# EAGLE design rf12socket5 (EAGLE 6.3)
ABBREV: jn6; PROJECT: JeeNode v6
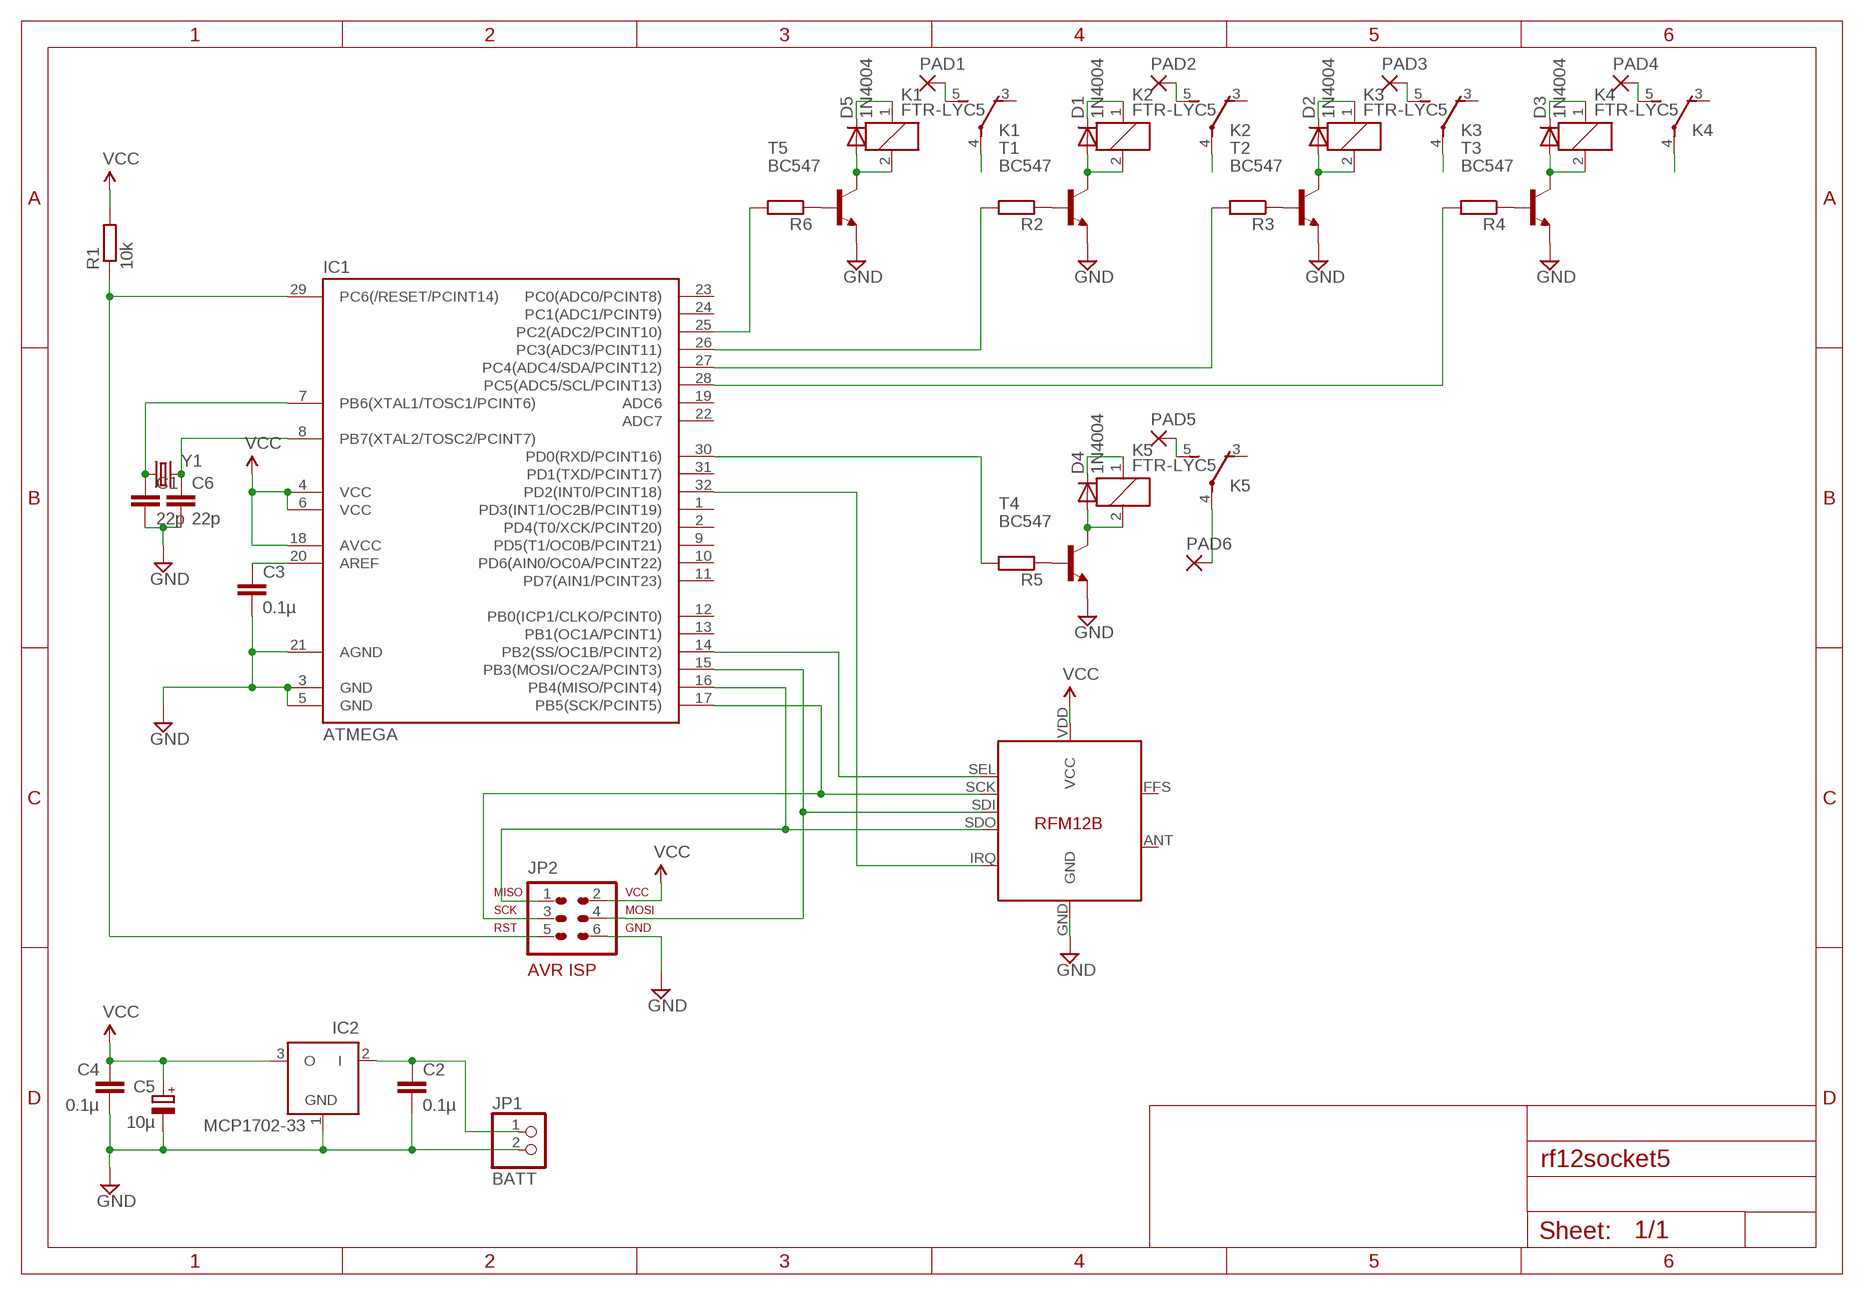
[diagram p0: schematic, sheet 1]

## Parts
C1  22p  CAPPTH  [CAP-PTH-SMALL]
C2  0.1µ  CAP0805  [0805]
C3  0.1µ  CAP0805  [0805]
C4  0.1µ  CAP0805  [0805]
C5  10µ  CPOL-EUE2.5-7  [E2,5-7]
C6  22p  CAPPTH  [CAP-PTH-SMALL]
D1  1N4004  [DO41-10]
D2  1N4004  [DO41-10]
D3  1N4004  [DO41-10]
D4  1N4004  [DO41-10]
D5  1N4004  [DO41-10]
IC1  ATMEGA  MEGA48/88/168-AU  [TQFP32-08]
IC2  MCP1702-33  MCP1702Z  [TO92]
JP1  BATT  PINHD-1X2  [1X02]
JP2  AVR-ISP-6VERT  [AVR-ISP-6]
K1  FTR-LYC5  [FTR-LYC]
K2  FTR-LYC5  [FTR-LYC]
K3  FTR-LYC5  [FTR-LYC]
K4  FTR-LYC5  [FTR-LYC]
K5  FTR-LYC5  [FTR-LYC]
PAD1  SMD5  [SMD2,54-5,08]
PAD2  SMD5  [SMD2,54-5,08]
PAD3  SMD5  [SMD2,54-5,08]
PAD4  SMD5  [SMD2,54-5,08]
PAD5  SMD5  [SMD2,54-5,08]
PAD6  SMD5  [SMD2,54-5,08]
R1  10k  R-EU_0207/10  [0207/10]
R2  R-EU_0207/10  [0207/10]
R3  R-EU_0207/10  [0207/10]
R4  R-EU_0207/10  [0207/10]
R5  R-EU_0207/10  [0207/10]
R6  R-EU_0207/10  [0207/10]
T1  BC547  [TO92]
T2  BC547  [TO92]
T3  BC547  [TO92]
T4  BC547  [TO92]
T5  BC547  [TO92]
U$1  RFM12B  [RFM12B]
Y1  CRYSTALHC49US  [HC49US]

## Nets
GND [power]: C1.2 C2.2 C3.2 C4.2 C5.- C6.2 IC1.3(GND) IC1.5(GND) IC1.21(AGND) IC2.1(GND) JP1.2 JP2.6 T1.1(E) T2.1(E) T3.1(E) T4.1(E) T5.1(E) U$1.GND
L230V: K1.4(-1:P) K2.4(-1:P) K3.4(-1:P) K4.4(-1:P) K5.4(-1:P) PAD6.1(P)
N$1: C1.1 IC1.7(PB6(XTAL1/TOSC1/PCINT6)) Y1.1
N$2: IC1.16(PB4(MISO/PCINT4)) JP2.1 U$1.SDO
N$3: IC1.15(PB3(MOSI/OC2A/PCINT3)) JP2.4 U$1.SDI
N$4: IC1.14(PB2(SS/OC1B/PCINT2)) U$1.SEL
N$5: IC1.17(PB5(SCK/PCINT5)) JP2.3 U$1.SCK
N$6: R2.1 T1.2(B)
N$7: IC1.32(PD2(INT0/PCINT18)) U$1.IRQ
N$8: D1.A K2.2 T1.3(C)
N$9: IC1.25(PC2(ADC2/PCINT10)) R6.2
N$10: R3.1 T2.2(B)
N$11: D2.A K3.2 T2.3(C)
N$12: R4.1 T3.2(B)
N$13: D3.A K4.2 T3.3(C)
N$14: R5.1 T4.2(B)
N$15: R6.1 T5.2(B)
N$16: D5.A K1.2 T5.3(C)
N$17: D4.A K5.2 T4.3(C)
N$18: IC1.26(PC3(ADC3/PCINT11)) R2.2
N$19: C3.1 IC1.20(AREF)
N$20: IC1.27(PC4(ADC4/SDA/PCINT12)) R3.2
N$21: C6.1 IC1.8(PB7(XTAL2/TOSC2/PCINT7)) Y1.2
N$22: IC1.28(PC5(ADC5/SCL/PCINT13)) R4.2
N$23: IC1.30(PD0(RXD/PCINT16)) R5.2
N$24: K5.5(-1:S) PAD5.1(P)
N$25: K1.5(-1:S) PAD1.1(P)
N$26: K2.5(-1:S) PAD2.1(P)
N$27: K3.5(-1:S) PAD3.1(P)
N$28: K4.5(-1:S) PAD4.1(P)
PWR [power]: C2.1 D1.C D2.C D3.C D4.C D5.C IC2.2(I) JP1.1 K1.1 K2.1 K3.1 K4.1 K5.1
RST: IC1.29(PC6(/RESET/PCINT14)) JP2.5 R1.1
VCC [power]: C4.1 C5.+ IC1.4(VCC) IC1.6(VCC) IC1.18(AVCC) IC2.3(O) JP2.2 R1.2 U$1.VDD(VCC)
Unconnected: IC1.1(PD3(INT1/OC2B/PCINT19)) IC1.2(PD4(T0/XCK/PCINT20)) IC1.9(PD5(T1/OC0B/PCINT21)) IC1.10(PD6(AIN0/OC0A/PCINT22)) IC1.11(PD7(AIN1/PCINT23)) IC1.12(PB0(ICP1/CLKO/PCINT0)) IC1.13(PB1(OC1A/PCINT1)) IC1.19(ADC6) IC1.22(ADC7) IC1.23(PC0(ADC0/PCINT8)) IC1.24(PC1(ADC1/PCINT9)) IC1.31(PD1(TXD/PCINT17)) K1.3(-1:O) K2.3(-1:O) K3.3(-1:O) K4.3(-1:O) K5.3(-1:O) U$1.ANT U$1.FFS

## Library data of the parts
C1-C4 C6 = SparkFun:CAP: Capacitor Standard 0603 ceramic capacitor, and 0.1" leaded capacitor.
C5 = rcl:CPOL-EU: POLARIZED CAPACITOR, European symbol
D1-D5 = diode:1N4004: DIODE general purpose rectifier, 1 A
IC1 = avr-7:MEGA48/88/168
IC2 = JeeLabs:MCP1702: 200 mA, Low Power Low Dropout Voltage Regulator
JP1 = pinhead:PINHD-1X2: PIN HEADER
JP2 = avr-7:AVR-ISP-6: AVR ISP-6 Serial Programming Header
K1-K5 = relay:FTR-LYC: Schmales Netzrelais NETZRELAIS FTR-LYCA024V 1XUM 6A/250VAC Distributor: Conrad electronic Bestell Nr.: 504382 - 62 Source: http://www2.produktinfo.conrad.com/datenblaetter/500000-524999/504382-da-01-de-NETZRELAIS_FTR-LYCA024V_1XUM_6A_250VAC.pdf; OC_FARNELL: unknown; OC_NEWARK: unknown
PAD1-PAD6 = wirepad:SMD5: SMD PAD
R1-R6 = rcl:R-EU_: RESISTOR, European symbol
T1-T5 = transistor:BC547: NPN TRANSISTOR
U$1 = JeeLabs:RFM12B
Y1 = SparkFun:CRYSTAL: Crystals Various standard crystals. Proven footprints. Spark Fun Electronics SKU : COM-00534

## Net classes
1 power: width 0.381 mm, clearance 0.254 mm

## Board
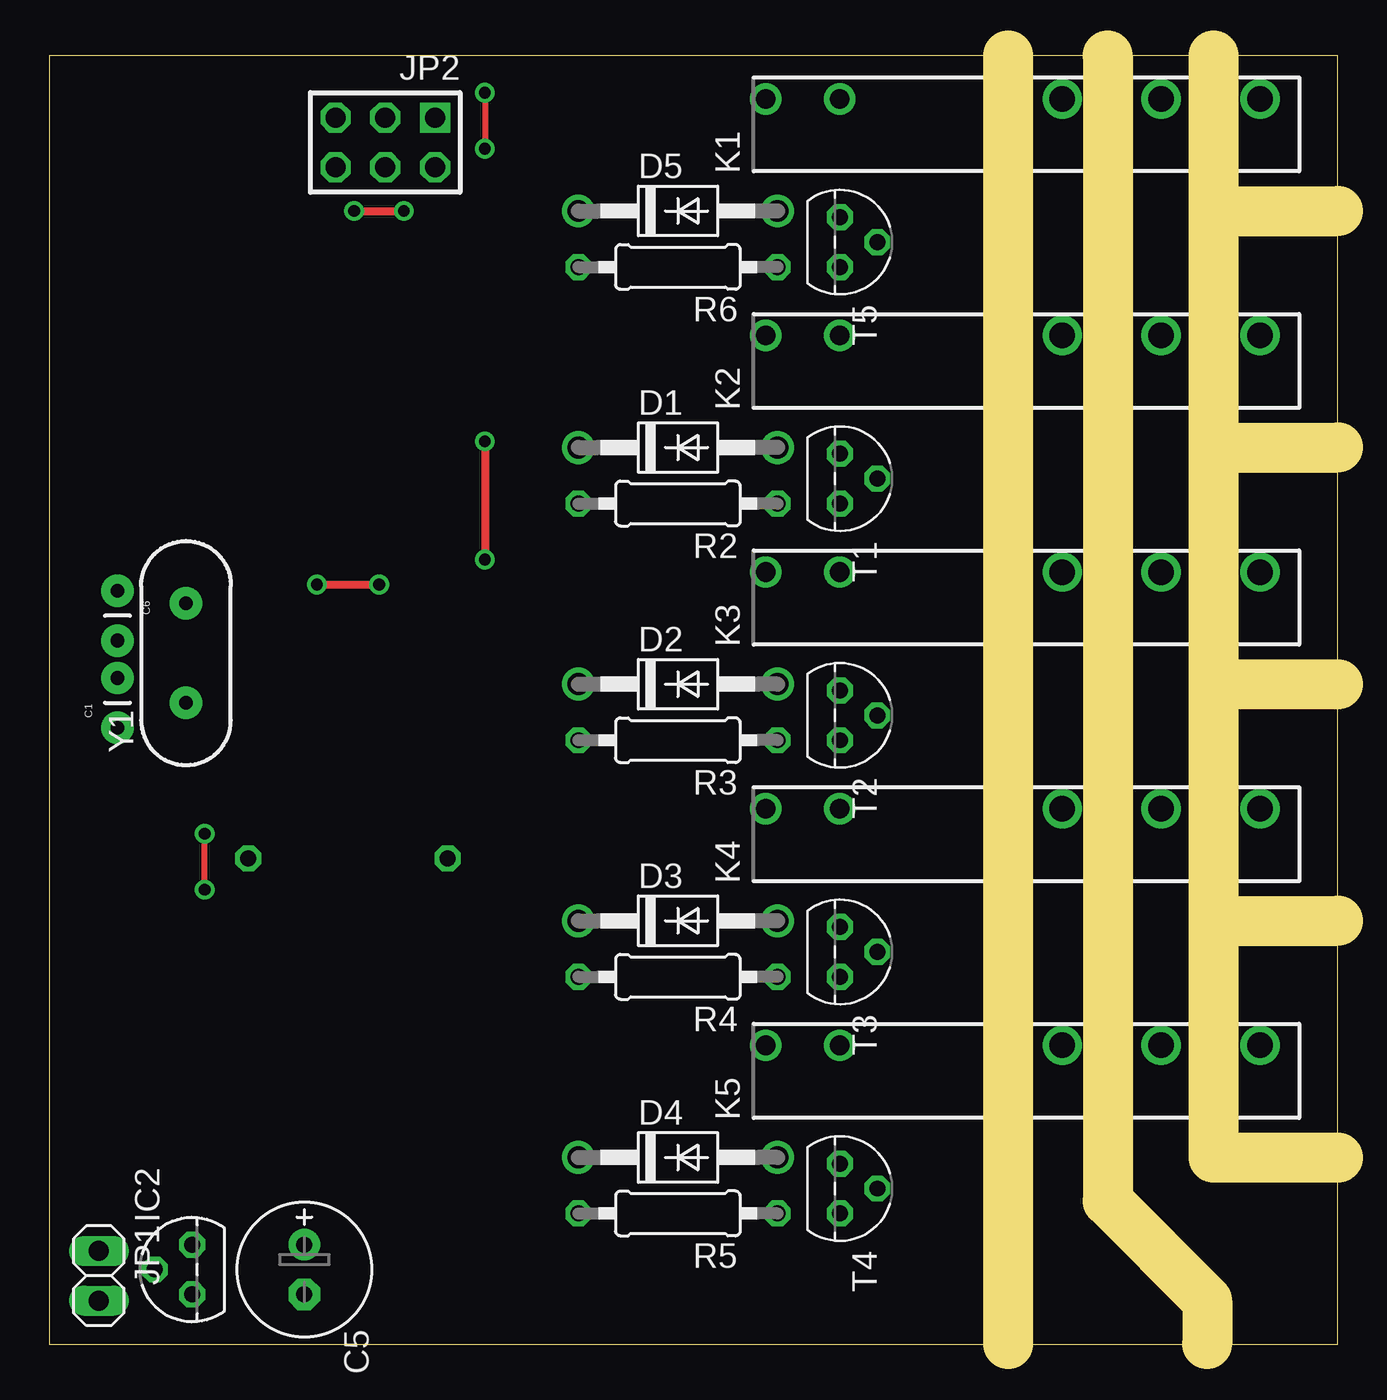
[diagram p1: board, top side]
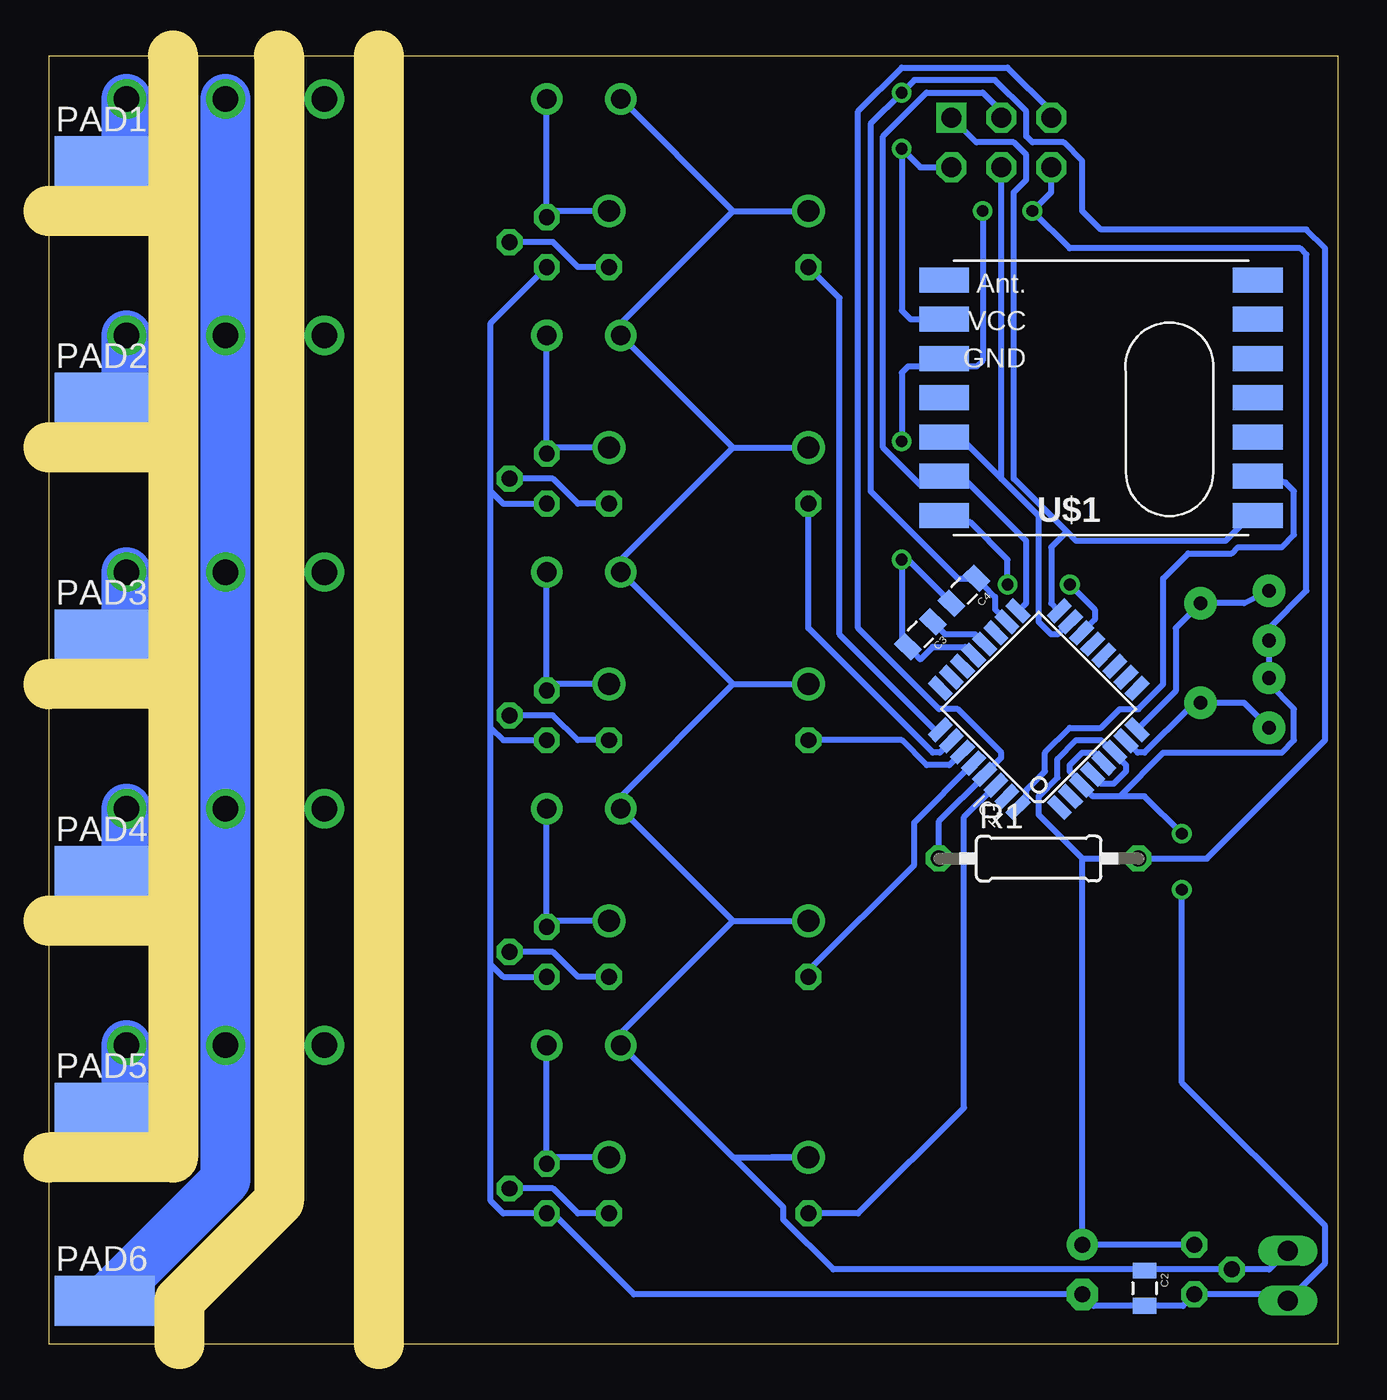
[diagram p2: board, bottom side, seen from below]

Size 65.7 x 65.71 mm. Coordinates in mm from the lower left corner, seen from the top.
Outline: 0,0 65.7,0 65.7,65.71 0,65.71 0,0
Copper layers (1*16): Top 0.035mm / dielectric 1.5mm / Bottom 0.035mm
Design rules "default": minimum track width 10mil, minimum drill 24mil, track to track 8mil, track to pad 8mil, pad to pad 8mil, via to via 8mil, smd to smd 8mil, copper to edge 40mil, drill to drill 8mil, minimum pad ring 10mil, minimum via ring 8mil, stop-mask expansion 4mil, vias tented up to drill 0mil, thermal gap 10mil
Milling: 10 lines

### Footprints (pad centres in the part's own frame; a part is rotated, then mirrored left to right if it is on the bottom)
CAP-PTH-SMALL = drill 0.7 pad 1.651 round: 1 0,0; 2 2.54,0
0805 = smd 0.8 x 1.2: 1 -0.9,0; 2 0.9,0
E2,5-7 = drill 0.813 pad 1.6 round: + -1.27,0 | drill 0.813 pad 1.6 octagon: - 1.27,0
DO41-10 = drill 1.118 round: A 5.08,0; C -5.08,0
TQFP32-08 = smd 1.27 x 0.559: 1 -4.293,2.8; 2 -4.293,2; 3 -4.293,1.2; 4 -4.293,0.4; 5 -4.293,-0.4; 6 -4.293,-1.2; 7 -4.293,-2; 8 -4.293,-2.8; 17 4.293,-2.8; 18 4.293,-2; 19 4.293,-1.2; 20 4.293,-0.4; 21 4.293,0.4; 22 4.293,1.2; 23 4.293,2; 24 4.293,2.8 | smd 0.559 x 1.27: 9 -2.8,-4.293; 10 -2,-4.293; 11 -1.2,-4.293; 12 -0.4,-4.293; 13 0.4,-4.293; 14 1.2,-4.293; 15 2,-4.293; 16 2.8,-4.293; 25 2.8,4.293; 26 2,4.293; 27 1.2,4.293; 28 0.4,4.293; 29 -0.4,4.293; 30 -1.2,4.293; 31 -2,4.293; 32 -2.8,4.293
TO92 = drill 0.813 octagon: 1 -1.27,0; 2 0,1.905; 3 1.27,0
1X02 = drill 1.016 long: 1 -1.27,0; 2 1.27,0
AVR-ISP-6 = drill 1.016 square: 1 -2.54,-1.27 | drill 1.016 octagon: 2 -2.54,1.27; 3 0,-1.27; 4 0,1.27; 5 2.54,-1.27; 6 2.54,1.27
FTR-LYC = drill 1 pad 1.6 round: 1 -3.78,0; 2 0,0 | drill 1.3 pad 2 round: 3 11.34,0; 4 16.38,0; 5 21.42,0
SMD2,54-5,08 = smd 2.54 x 5.08: 1 0,0
0207/10 = drill 0.813 octagon: 1 -5.08,0; 2 5.08,0
TO92' = drill 0.813 octagon: 1 1.27,0; 2 0,1.905; 3 -1.27,0
RFM12B = smd 2.54 x 1.27: ANT 8,-6; FFS -8,2; GND 8,-2; IRQ -8,4; P$8 -8,0; P$9 -8,-2; P$10 -8,-4; P$12 -8,-6; P$16 8,0; SCK 8,4; SDI 8,2; SDO -8,6; SEL 8,6; VDD 8,-4
HC49US = drill 0.7 pad 1.651 round: 1 -2.54,0; 2 2.54,0

### Placement (x,y rotation side)
C1  3.49,31.43 90 top
C2  9.84,2.86 270 bottom
C3  21.27,36.2 225 bottom
C4  19.05,38.42 225 bottom
C5  13.02,3.81 270 top
C6  3.49,38.42 270 top
D1  32.07,45.72 0 top
D2  32.07,33.66 0 top
D3  32.07,21.59 0 top
D4  32.07,9.53 0 top
D5  32.07,57.78 0 top
IC1  15.24,32.38 135 bottom
IC2  7.3,3.81 90 top
JP1  2.54,3.49 270 top
JP2  17.14,61.28 180 top
K1  40.32,63.5 0 top
K2  40.32,51.44 0 top
K3  40.32,39.37 0 top
K4  40.32,27.3 0 top
K5  40.32,15.24 0 top
PAD1  62.87,60.33 270 bottom
PAD2  62.87,48.26 270 bottom
PAD3  62.87,36.2 270 bottom
PAD4  62.87,24.13 270 bottom
PAD5  62.87,12.06 270 bottom
PAD6  62.87,2.22 270 bottom
R1  15.24,24.77 0 bottom
R2  32.07,42.86 180 top
R3  32.07,30.8 180 top
R4  32.07,18.73 180 top
R5  32.07,6.67 180 top
R6  32.07,54.93 180 top
T1  BC547  [TO92']  40.32,44.13 270 top
T2  BC547  [TO92']  40.32,32.07 270 top
T3  BC547  [TO92']  40.32,20 270 top
T4  BC547  [TO92']  40.32,7.94 270 top
T5  BC547  [TO92']  40.32,56.2 270 top
U$1  12.06,48.26 180 bottom
Y1  6.99,35.24 90 top

### Tracks (layer width: path | path; a pad name or v marks a point on that pad's centre or on a via)
GND  (via drill 0.6)
  Top 0.305: v7.94,23.18 v7.94,26.04
  Top 0.406: v15.56,57.78 v18.1,57.78 | v22.23,46.04 v22.23,40.01
  Bottom 0.305: IC1.5 12.06,29.84 12.38,30.16 13.02,30.16 13.65,29.53 13.65,29.21 13.02,28.57 IC1.3 12.49,27.94 11.11,27.94 | JP2.6 14.61,58.74 v15.56,57.78 13.65,55.88 1.91,55.88 1.59,55.56 1.59,38.42 3.49,36.51 C6.2 C1.2 3.49,33.66 2.22,32.38 2.22,30.8 2.86,30.16 8.89,30.16 11.11,27.94 | v18.1,57.78 18.1,50.16 18.41,49.85 19.97,49.85 U$1.GND | IC1.21 18.98,35.56 20.64,35.56 21.27,34.92 21.59,35.24 C3.2 21.91,35.24 C3.2 22.23,35.88 v22.23,40.01 21.91,40.01 C4.2 | 20.32,49.85 21.91,49.85 22.23,49.53 v22.23,46.04 | T3.1 42.55,18.73 43.18,19.37 | T2.1 42.55,30.8 43.18,31.43 | T1.1 42.55,42.86 43.18,43.5 | 43.18,43.5 43.18,52.07 T5.1 | 43.18,31.43 43.18,43.5 | 43.18,19.37 43.18,31.43 | 43.18,19.37 43.18,7.3 42.55,6.67 T4.1 40.01,6.67 35.88,2.54 C5.- 12.44,1.96 C2.2 7.88,1.96 IC2.1 2.86,2.54 JP1.2 0.64,4.13 0.64,6.03 7.94,13.34 v7.94,23.18 | 11.11,27.94 9.84,27.94 v7.94,26.04
  Bottom 0.406: 20,49.85 U$1.GND 20.32,49.85
L230V
  Bottom 2.54: K1.4 K2.4 K3.4 K4.4 K5.4 56.7,8.38 PAD6.1
N$1
  Bottom 0.305: IC1.7 10.19,30.16 9.84,30.16 7.62,32.38 7.3,32.38 Y1.1 4.76,32.7 C1.1
  Bottom 0.406: IC1.7 10.48,30.48
N$2
  Bottom 0.305: 14.29,37.47 14.61,37.78 14.61,40.64 13.81,41.43 | U$1.SDO 4.1,41.91 4.76,41.91 5.71,40.96 13.34,40.96 13.81,41.43 | JP2.1 18.41,61.28 16.51,61.28 15.88,60.64 15.88,59.37 16.51,58.74 16.51,44.13 13.81,41.43 | 13.81,41.43
  Bottom 0.406: U$1.SDO 4.13,41.91 | 14.29,37.47 IC1.16
N$3
  Bottom 0.305: IC1.15 13.65,36.83 14.29,36.2 14.61,36.2 15.24,36.83 15.24,42.23 17.14,44.13 | 17.14,44.13 19.05,46.04 19.97,46.04 U$1.SDI | 17.14,44.13 JP2.4
  Bottom 0.406: U$1.SDI 20,46.04 | IC1.15 13.65,36.83
N$4  (via drill 0.6)
  Top 0.406: v13.65,38.73 v16.83,38.73
  Bottom 0.305: 20,41.91 18.73,41.91 16.83,40.01 v16.83,38.73 | IC1.14 12.38,36.94 12.38,37.47 v13.65,38.73
  Bottom 0.406: 20,41.91 U$1.SEL | 13.02,36.2 IC1.14 12.94,36.27
N$5
  Bottom 0.305: 16.19,37.47 15.88,37.78 15.88,40.96 19.05,44.13 19.88,44.13 U$1.SCK | 20.32,43.81 21.27,43.81 23.18,45.72 23.18,61.59 20.95,63.82 18.1,63.82 17.14,62.87 JP2.3
  Bottom 0.406: IC1.17 16.19,37.47 | 20,43.81 U$1.SCK 20.32,43.81
N$6
  Bottom 0.305: T1.2 40.01,44.13 38.73,42.86 R2.1
N$7
  Bottom 0.305: U$1.IRQ 2.67,43.94 2.22,43.5 2.22,41.27 2.86,40.64 5.08,40.64 5.4,40.32 7.62,40.32 8.89,39.05 8.89,33.66 10.16,32.38 11.11,32.38 12.06,31.43 13.65,31.43 14.92,30.16 14.92,29.21 15.88,28.26 15.88,27.79 IC1.32
N$8
  Bottom 0.305: D1.A 40.01,45.72 T1.3 K2.2
N$9
  Bottom 0.305: IC1.25 20.54,31.33 25.4,36.2 25.4,53.34 R6.2
N$10
  Bottom 0.305: R3.1 38.73,30.8 40.01,32.07 T2.2
N$11
  Bottom 0.305: D2.A 40.01,33.66 T2.3 K3.2
N$12
  Bottom 0.305: R4.1 38.73,18.73 40.01,20 T3.2
N$13
  Bottom 0.305: D3.A 40.01,21.59 T3.3 K4.2
N$14
  Bottom 0.305: R5.1 38.73,6.67 40.01,7.94 T4.2
N$15
  Bottom 0.305: R6.1 38.73,54.93 40.01,56.2 T5.2
N$16
  Bottom 0.305: D5.A 40.01,57.78 T5.3 K1.2
N$17
  Bottom 0.305: T4.3 40.32,9.53 | T4.3 K5.2 | D4.A 40.01,9.53 T4.3
N$18
  Bottom 0.305: IC1.26 20.29,30.16 20.64,30.16 26.99,36.51 R2.2
N$19
  Bottom 0.305: IC1.20 18.48,36.2 20,36.2 20.32,36.51 C3.1
N$20
  Bottom 0.305: IC1.27 19.8,29.53 20.95,29.53 22.23,30.8 R3.2
N$21
  Bottom 0.305: IC1.8 8.26,33.3 8.26,36.51 Y1.2 4.76,37.78 C6.1
N$22
  Bottom 0.305: 18.63,29.63 IC1.28 21.59,26.6 21.59,24.45 26.99,19.05 R4.2
N$23
  Bottom 0.305: IC1.30 19.05,26.88 19.05,12.06 24.45,6.67 R5.2
N$24
  Bottom 2.54: K5.5 61.74,12.21 PAD5.1
N$25
  Bottom 2.54: K1.5 61.74,60.47 PAD1.1
N$26
  Bottom 2.54: K2.5 61.74,48.41 PAD2.1
N$27
  Bottom 2.54: K3.5 61.74,36.34 PAD3.1
N$28
  Bottom 2.54: K4.5 61.74,24.28 PAD4.1
PWR
  Bottom 0.305: 30.8,9.53 D4.C 28.89,9.53 | 30.8,9.53 30.83,9.53 | 30.83,9.53 K5.1 36.54,15.88 30.83,21.59 | 30.83,21.59 D3.C | 30.83,21.59 K4.1 36.54,27.94 30.83,33.66 | 30.83,33.66 D2.C | 30.83,33.66 K3.1 36.54,40.01 30.83,45.72 | 30.83,45.72 D1.C | 30.83,45.72 K2.1 36.54,52.07 30.83,57.78 | 30.83,57.78 D5.C | 30.83,57.78 K1.1 | 2.59,4.71 JP1.1 3.49,3.81 IC2.2 9.84,3.81 C2.1 9.89,3.81 25.72,3.81 28.26,6.35 28.26,6.99 30.8,9.53 | 30.83,9.53 30.8,9.49
RST
  Bottom 0.305: JP2.5 14.61,62.87 16.83,65.09 22.23,65.09 24.45,62.87 24.45,36.51 20.32,32.38 19.37,32.38 17.14,30.16 17.14,29.91 IC1.29 17.99,29 20.32,26.67 R1.1
VCC  (via drill 0.6)
  Top 0.305: v22.23,63.82 v22.23,60.96
  Bottom 0.305: 11.43,30.16 10.79,29.53 10.79,29.21 11.43,28.57 12.06,28.57 12.38,28.89 IC1.4 | 11.43,30.16 IC1.6 | 11.43,30.16 12.06,30.8 13.34,30.8 14.29,29.84 14.29,28.89 15.24,27.94 15.24,26.99 13.02,24.77 | 19.94,52.07 U$1.VDD 21.78,52.26 22.23,52.7 v22.23,60.96 21.27,60.01 JP2.2 | 17.14,37.15 17.46,37.47 17.46,38.1 18.1,38.73 C4.1 19.37,39.05 23.81,43.5 23.81,62.23 v22.23,63.82 21.59,64.45 17.46,64.45 15.88,62.87 15.88,61.59 15.56,61.28 13.97,61.28 13.02,60.33 13.02,57.78 12.06,56.83 1.59,56.83 0.64,55.88 0.64,30.8 6.67,24.77 R1.2 13.02,24.77 | IC2.3 C5.+ 13.02,24.77
  Bottom 0.406: 17.14,37.15 IC1.18 | U$1.VDD 20,52.07